# Altium schematic sheet fpga_block.SchDoc
size A3
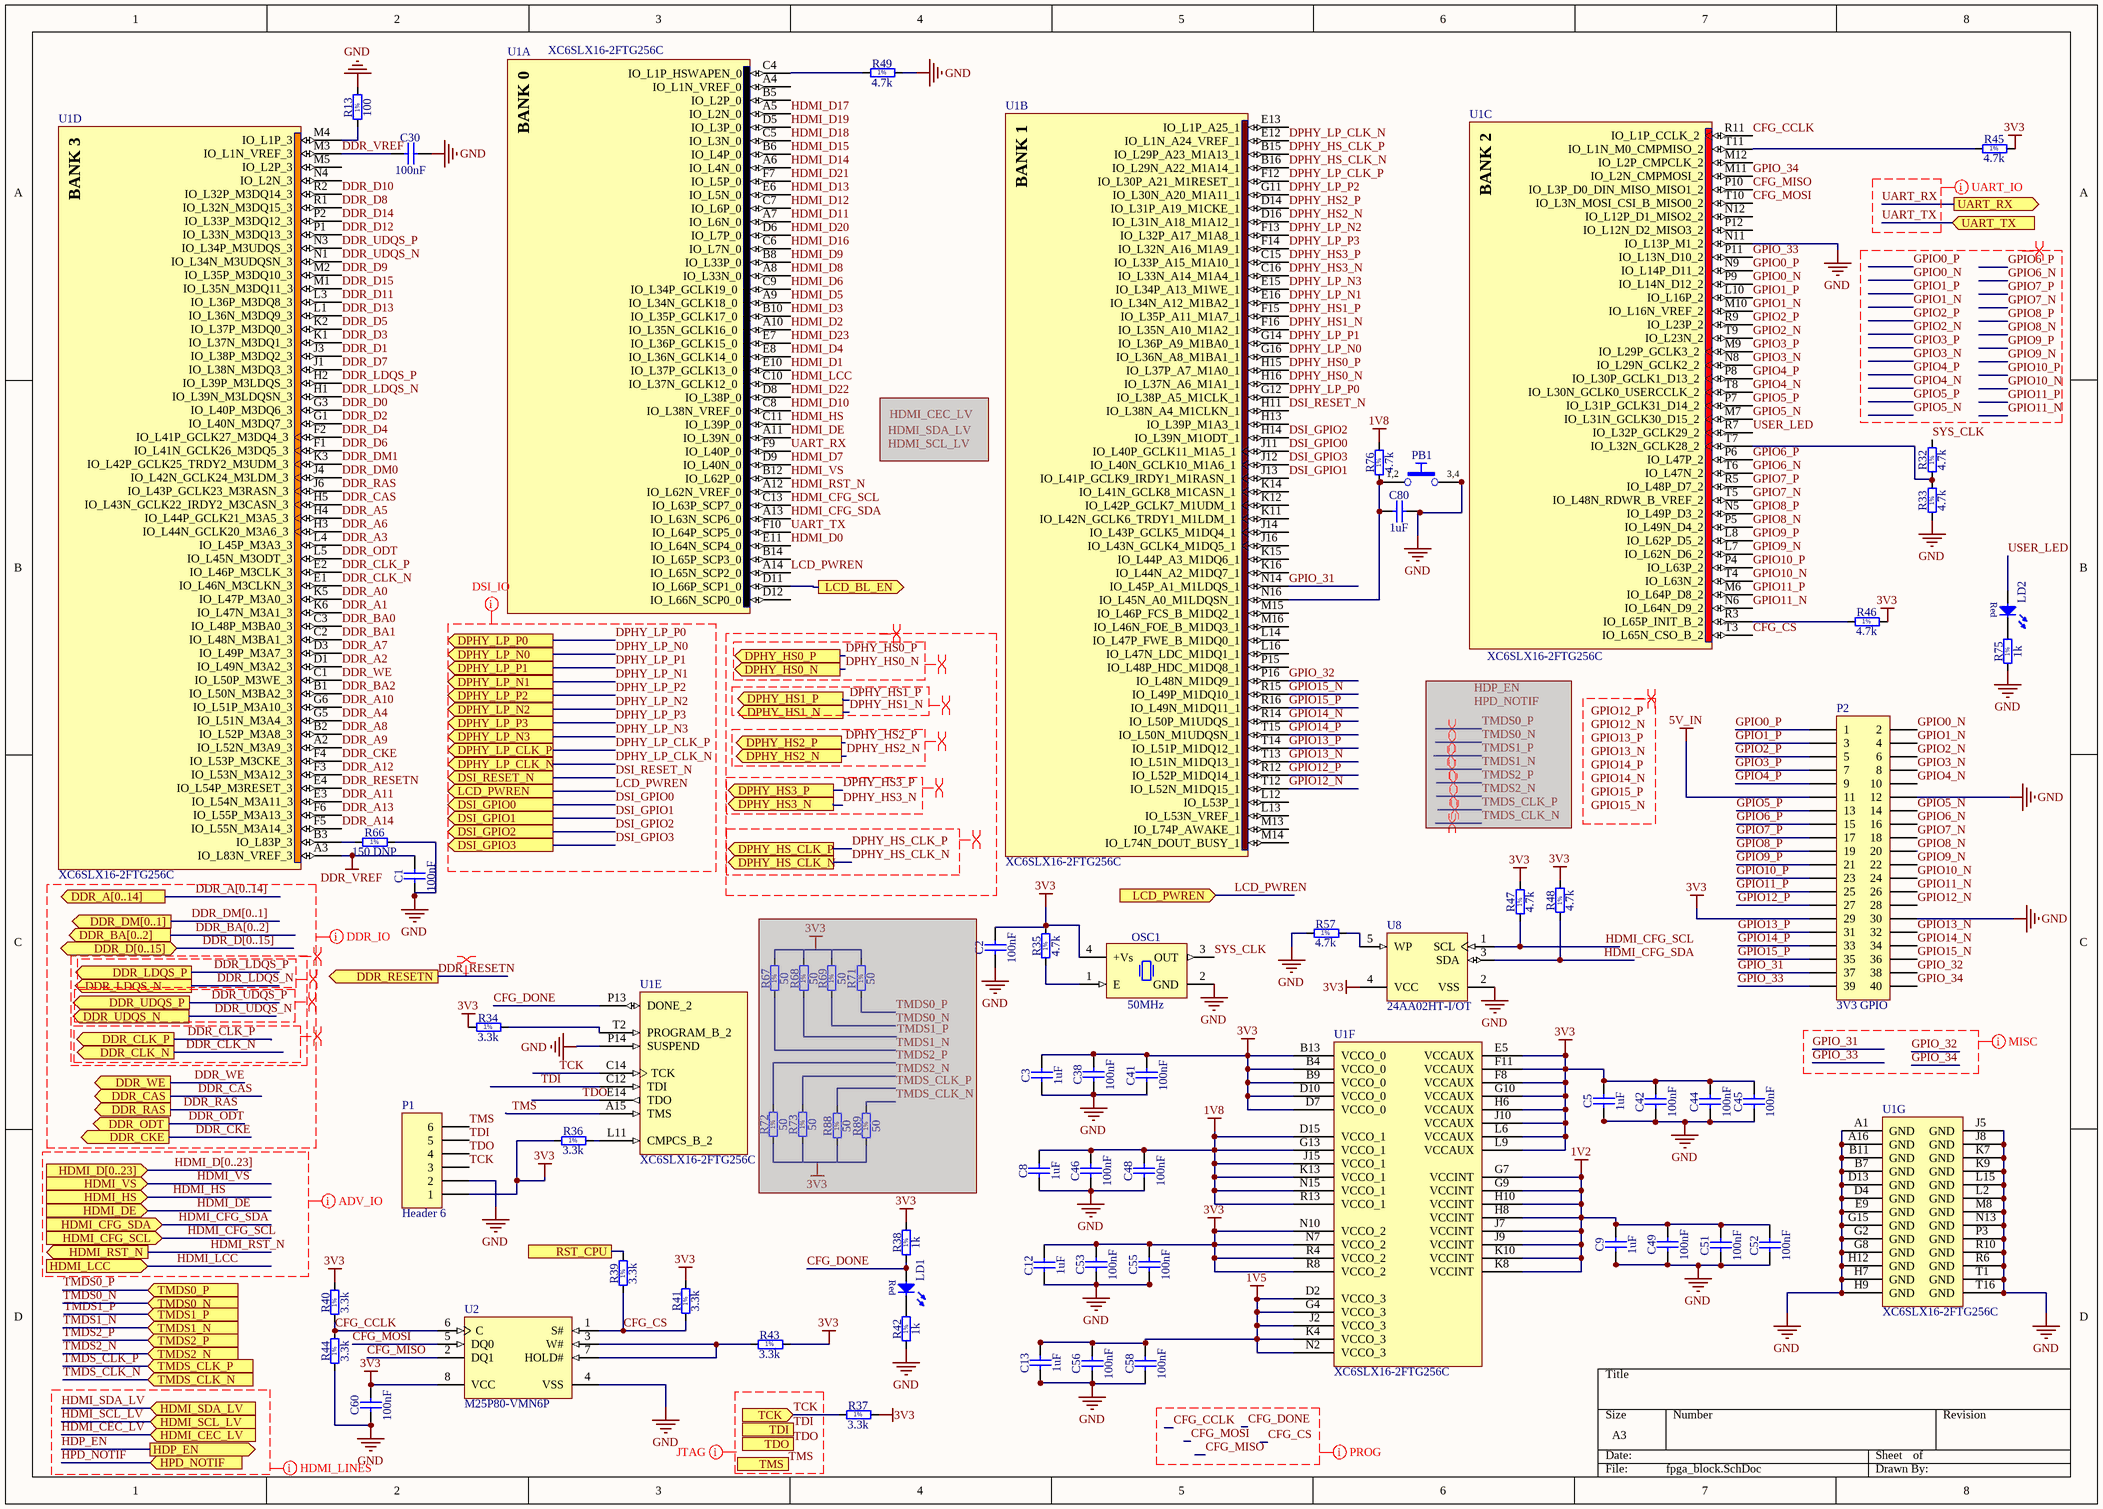
[diagram p0: fpga_block.SchDoc]

## Parts
C1  100nF  [CAPC1005X55N]
C2  100nF  [CAPC1005X55N]
C3  1uF  [CAPC1005X55N]
C5  1uF  [CAPC1005X55N]
C8  1uF  [CAPC1005X55N]
C9  1uF  [CAPC1005X55N]
C12  1uF  [CAPC1005X55N]
C13  1uF  [CAPC1005X55N]
C30  100nF  [CAPC1005X55N]
C38  100nF  [CAPC1005X55N]
C41  100nF  [CAPC1005X55N]
C42  100nF  [CAPC1005X55N]
C44  100nF  [CAPC1005X55N]
C45  100nF  [CAPC1005X55N]
C46  100nF  [CAPC1005X55N]
C48  100nF  [CAPC1005X55N]
C49  100nF  [CAPC1005X55N]
C51  100nF  [CAPC1005X55N]
C52  100nF  [CAPC1005X55N]
C53  100nF  [CAPC1005X55N]
C55  100nF  [CAPC1005X55N]
C56  100nF  [CAPC1005X55N]
C58  100nF  [CAPC1005X55N]
C60  100nF  [CAPC2013X100N]
C80  1uF  [CAPC1005X55N]
LD1  Super Red  [LED_OSRAM_LSR976]  (value not drawn)
LD2  Super Red  [LED_OSRAM_LSR976]  (value not drawn)
OSC1  50MHz  [OSC_IQD_CFPS-69]
P1  Header 6  [HDR1X6]
P2  3V3 GPIO  [HDR2X20]
PB1  Push Button  [PB_TYCO_FSM6JSMA]  (value not drawn)
R13  100  [RESC1608X55N]
R32  4.7k  [RESC1608X55N]
R33  4.7k  [RESC1608X55N]
R34  3.3k  [RESC1608X55N]
R35  4.7k  [RESC1608X55N]
R36  3.3k  [RESC1608X55N]
R37  3.3k  [RESC1608X55N]
R38  1k  [RESC1608X55N]
R39  3.3k  [RESC1608X55N]
R40  3.3k  [RESC1608X55N]
R41  3.3k  [RESC1608X55N]
R42  1k  [RESC1608X55N]
R43  3.3k  [RESC1608X55N]
R44  3.3k  [RESC1608X55N]
R45  4.7k  [RESC1608X55N]
R46  4.7k  [RESC1608X55N]
R47  4.7k  [RESC1608X55N]
R48  4.7k  [RESC1608X55N]
R49  4.7k  [RESC1608X55N]
R57  4.7k  [RESC1608X55N]
R66  150 DNP  [RESC1608X55N]
R67  50  [RESC1005X40N]  (masked out: inside a compile mask, not in the netlist)
R68  50  [RESC1005X40N]  (masked out: inside a compile mask, not in the netlist)
R69  50  [RESC1005X40N]  (masked out: inside a compile mask, not in the netlist)
R71  50  [RESC1005X40N]  (masked out: inside a compile mask, not in the netlist)
R72  50  [RESC1005X40N]  (masked out: inside a compile mask, not in the netlist)
R73  50  [RESC1005X40N]  (masked out: inside a compile mask, not in the netlist)
R75  1k  [RESC1608X55N]
R76  4.7k  [RESC1608X55N]
R88  50  [RESC1005X40N]  (masked out: inside a compile mask, not in the netlist)
R89  50  [RESC1005X40N]  (masked out: inside a compile mask, not in the netlist)
U1  XC6SLX16-2FTG256C  [FTG256]  (parts A,B,C,D,E,F,G of 7)
U2  M25P80-VMN6P  [MICT-MN-8_N]
U8  24AA02HT-I/OT  [SOT-23-OT5_L]

## Ports
DDR_A[0..14] (out), DDR_BA[0..2] (out), DDR_CAS (out), DDR_CKE (out), DDR_CLK_N (out), DDR_CLK_P (out), DDR_D[0..15] (bidir), DDR_DM[0..1] (out), DDR_LDQS_N (out), DDR_LDQS_P (out), DDR_ODT (out), DDR_RAS (out), DDR_RESETN (out), DDR_UDQS_N (out), DDR_UDQS_P (out), DDR_WE (out), DPHY_HS0_N (out), DPHY_HS0_P (out), DPHY_HS1_N (out), DPHY_HS1_P (out), DPHY_HS2_N (out), DPHY_HS2_P (out), DPHY_HS3_N (out), DPHY_HS3_P (out), DPHY_HS_CLK_N (out), DPHY_HS_CLK_P (out), DPHY_LP_CLK_N (out), DPHY_LP_CLK_P (out), DPHY_LP_N0 (out), DPHY_LP_N1 (out), DPHY_LP_N2 (out), DPHY_LP_N3 (out), DPHY_LP_P0 (out), DPHY_LP_P1 (out), DPHY_LP_P2 (out), DPHY_LP_P3 (out), DSI_GPIO0 (out), DSI_GPIO1 (out), DSI_GPIO2 (out), DSI_GPIO3 (out), DSI_RESET_N (out), HDMI_CEC_LV (in), HDMI_CFG_SCL (in), HDMI_CFG_SDA (in), HDMI_D[0..23] (in), HDMI_DE (in), HDMI_HS (in), HDMI_LCC (in), HDMI_RST_N (out), HDMI_SCL_LV (in), HDMI_SDA_LV (in), HDMI_VS (in), HDP_EN (out), HPD_NOTIF (in), LCD_BL_EN (out), LCD_PWREN (in), LCD_PWREN (out), RST_CPU, TCK (in), TDI (in), TDO (out), TMDS0_N (in), TMDS0_P (in), TMDS1_N (in), TMDS1_P (in), TMDS2_N (in), TMDS2_P (in), TMDS_CLK_N (in), TMDS_CLK_P (in), TMS (out), UART_RX (out), UART_TX (in)

## Nets
1V2: C9.2 C49.2 C51.2 C52.2 U1.G7(VCCINT) U1.G9(VCCINT) U1.H8(VCCINT) U1.H10(VCCINT) U1.J7(VCCINT) U1.J9(VCCINT) U1.K8(VCCINT) U1.K10(VCCINT)
1V5: C13.2 C56.2 C58.2 U1.D2(VCCO_3) U1.G4(VCCO_3) U1.J2(VCCO_3) U1.K4(VCCO_3) U1.N2(VCCO_3)
1V8: C8.2 C46.2 C48.2 R76.2 U1.D15(VCCO_1) U1.G13(VCCO_1) U1.J15(VCCO_1) U1.K13(VCCO_1) U1.N15(VCCO_1) U1.R13(VCCO_1)
3V3: C2.2 C3.2 C5.2 C12.2 C38.2 C41.2 C42.2 C44.2 C45.2 C53.2 C55.2 C60.2 OSC1.4(+Vs) P1.1 P2.29 R34.1 R35.2 R36.1 R37.2 R38.2 R40.2 R41.2 R43.2 R45.2 R46.2 R47.2 R48.2 U1.B4(VCCO_0) U1.B9(VCCO_0) U1.B13(VCCO_0) U1.D7(VCCO_0) U1.D10(VCCO_0) U1.E5(VCCAUX) U1.F8(VCCAUX) U1.F11(VCCAUX) U1.G10(VCCAUX) U1.H6(VCCAUX) U1.J10(VCCAUX) U1.L6(VCCAUX) U1.L9(VCCAUX) U1.N7(VCCO_2) U1.N10(VCCO_2) U1.R4(VCCO_2) U1.R8(VCCO_2) U2.8(VCC) U8.4(VCC)
5V_IN: P2.11
DDR_VREF: C1.2 C30.1 U1.A3(IO_L83N_VREF_3) U1.M3(IO_L1N_VREF_3)
GND: C1.1 C2.1 C3.1 C5.1 C8.1 C9.1 C12.1 C13.1 C30.2 C38.1 C41.1 C42.1 C44.1 C45.1 C46.1 C48.1 C49.1 C51.1 C52.1 C53.1 C55.1 C56.1 C58.1 C60.1 C80.2 OSC1.2(GND) P1.2 P2.12 P2.30 PB1.3 PB1.4 R13.2 R33.1 R42.1 R44.1 R49.2 R57.1 R66.2 R75.1 U1.A1(GND) U1.A16(GND) U1.B7(GND) U1.B11(GND) U1.D4(GND) U1.D13(GND) U1.E9(GND) U1.G2(GND) U1.G8(GND) U1.G15(GND) U1.H7(GND) U1.H9(GND) U1.H12(GND) U1.J5(GND) U1.J8(GND) U1.K7(GND) U1.K9(GND) U1.L2(GND) U1.L15(GND) U1.M8(GND) U1.N11(IO_L13P_M1_2) U1.N13(GND) U1.P3(GND) U1.P14(SUSPEND) U1.R6(GND) U1.R10(GND) U1.T1(GND) U1.T16(GND) U2.4(VSS) U8.2(VSS)
CFG_CCLK: R40.1 R44.2 U1.R11(IO_L1P_CCLK_2) U2.6(C)
CFG_CS: R39.1 R41.1 U1.T3(IO_L65N_CSO_B_2) U2.1(S#)
CFG_DONE: LD1.2(A) R38.1 U1.P13(DONE_2)
CFG_MISO: U1.P10(IO_L3P_D0_DIN_MISO_MISO1_2) U2.2(DQ1)
CFG_MOSI: U1.T10(IO_L3N_MOSI_CSI_B_MISO0_2) U2.5(DQ0)
DDR_A0: U1.K5(IO_L47P_M3A0_3)
DDR_A1: U1.K6(IO_L47N_M3A1_3)
DDR_A2: U1.D1(IO_L49N_M3A2_3)
DDR_A3: U1.L4(IO_L45P_M3A3_3)
DDR_A4: U1.G5(IO_L51N_M3A4_3)
DDR_A5: U1.H4(IO_L44P_GCLK21_M3A5_3)
DDR_A6: U1.H3(IO_L44N_GCLK20_M3A6_3)
DDR_A7: U1.D3(IO_L49P_M3A7_3)
DDR_A8: U1.B2(IO_L52P_M3A8_3)
DDR_A9: U1.A2(IO_L52N_M3A9_3)
DDR_A10: U1.G6(IO_L51P_M3A10_3)
DDR_A11: U1.E3(IO_L54N_M3A11_3)
DDR_A12: U1.F3(IO_L53N_M3A12_3)
DDR_A13: U1.F6(IO_L55P_M3A13_3)
DDR_A14: U1.F5(IO_L55N_M3A14_3)
DDR_BA0: U1.C3(IO_L48P_M3BA0_3)
DDR_BA1: U1.C2(IO_L48N_M3BA1_3)
DDR_BA2: U1.B1(IO_L50N_M3BA2_3)
DDR_CAS: U1.H5(IO_L43N_GCLK22_IRDY2_M3CASN_3) ; port DDR_CAS
DDR_CKE: U1.F4(IO_L53P_M3CKE_3) ; port DDR_CKE
DDR_CLK_N: U1.E1(IO_L46N_M3CLKN_3) ; port DDR_CLK_N
DDR_CLK_P: U1.E2(IO_L46P_M3CLK_3) ; port DDR_CLK_P
DDR_D0: U1.G3(IO_L40P_M3DQ6_3)
DDR_D1: U1.J3(IO_L38P_M3DQ2_3)
DDR_D2: U1.G1(IO_L40N_M3DQ7_3)
DDR_D3: U1.K1(IO_L37N_M3DQ1_3)
DDR_D4: U1.F2(IO_L41P_GCLK27_M3DQ4_3)
DDR_D5: U1.K2(IO_L37P_M3DQ0_3)
DDR_D6: U1.F1(IO_L41N_GCLK26_M3DQ5_3)
DDR_D7: U1.J1(IO_L38N_M3DQ3_3)
DDR_D8: U1.R1(IO_L32N_M3DQ15_3)
DDR_D9: U1.M2(IO_L35P_M3DQ10_3)
DDR_D10: U1.R2(IO_L32P_M3DQ14_3)
DDR_D11: U1.L3(IO_L36P_M3DQ8_3)
DDR_D12: U1.P1(IO_L33N_M3DQ13_3)
DDR_D13: U1.L1(IO_L36N_M3DQ9_3)
DDR_D14: U1.P2(IO_L33P_M3DQ12_3)
DDR_D15: U1.M1(IO_L35N_M3DQ11_3)
DDR_DM0: U1.J4(IO_L42N_GCLK24_M3LDM_3)
DDR_DM1: U1.K3(IO_L42P_GCLK25_TRDY2_M3UDM_3)
DDR_LDQS_N: U1.H1(IO_L39N_M3LDQSN_3) ; port DDR_LDQS_N
DDR_LDQS_P: U1.H2(IO_L39P_M3LDQS_3) ; port DDR_LDQS_P
DDR_ODT: U1.L5(IO_L45N_M3ODT_3) ; port DDR_ODT
DDR_RAS: U1.J6(IO_L43P_GCLK23_M3RASN_3) ; port DDR_RAS
DDR_RESETN: U1.E4(IO_L54P_M3RESET_3) ; port DDR_RESETN
DDR_UDQS_N: U1.N1(IO_L34N_M3UDQSN_3) ; port DDR_UDQS_N
DDR_UDQS_P: U1.N3(IO_L34P_M3UDQS_3) ; port DDR_UDQS_P
DDR_WE: U1.C1(IO_L50P_M3WE_3) ; port DDR_WE
DPHY_HS0_N: U1.H16(IO_L37N_A6_M1A1_1) ; port DPHY_HS0_N
DPHY_HS0_P: U1.H15(IO_L37P_A7_M1A0_1) ; port DPHY_HS0_P
DPHY_HS1_N: U1.F16(IO_L35N_A10_M1A2_1) ; port DPHY_HS1_N
DPHY_HS1_P: U1.F15(IO_L35P_A11_M1A7_1) ; port DPHY_HS1_P
DPHY_HS2_N: U1.D16(IO_L31N_A18_M1A12_1) ; port DPHY_HS2_N
DPHY_HS2_P: U1.D14(IO_L31P_A19_M1CKE_1) ; port DPHY_HS2_P
DPHY_HS3_N: U1.C16(IO_L33N_A14_M1A4_1) ; port DPHY_HS3_N
DPHY_HS3_P: U1.C15(IO_L33P_A15_M1A10_1) ; port DPHY_HS3_P
DPHY_HS_CLK_N: U1.B16(IO_L29N_A22_M1A14_1) ; port DPHY_HS_CLK_N
DPHY_HS_CLK_P: U1.B15(IO_L29P_A23_M1A13_1) ; port DPHY_HS_CLK_P
DPHY_LP_CLK_N: U1.E12(IO_L1N_A24_VREF_1) ; port DPHY_LP_CLK_N
DPHY_LP_CLK_P: U1.F12(IO_L30P_A21_M1RESET_1) ; port DPHY_LP_CLK_P
DPHY_LP_N0: U1.G16(IO_L36N_A8_M1BA1_1) ; port DPHY_LP_N0
DPHY_LP_N1: U1.E16(IO_L34N_A12_M1BA2_1) ; port DPHY_LP_N1
DPHY_LP_N2: U1.F13(IO_L32P_A17_M1A8_1) ; port DPHY_LP_N2
DPHY_LP_N3: U1.E15(IO_L34P_A13_M1WE_1) ; port DPHY_LP_N3
DPHY_LP_P0: U1.G12(IO_L38P_A5_M1CLK_1) ; port DPHY_LP_P0
DPHY_LP_P1: U1.G14(IO_L36P_A9_M1BA0_1) ; port DPHY_LP_P1
DPHY_LP_P2: U1.G11(IO_L30N_A20_M1A11_1) ; port DPHY_LP_P2
DPHY_LP_P3: U1.F14(IO_L32N_A16_M1A9_1) ; port DPHY_LP_P3
DSI_GPIO0: U1.J11(IO_L40P_GCLK11_M1A5_1) ; port DSI_GPIO0
DSI_GPIO1: U1.J13(IO_L41P_GCLK9_IRDY1_M1RASN_1) ; port DSI_GPIO1
DSI_GPIO2: U1.H14(IO_L39N_M1ODT_1) ; port DSI_GPIO2
DSI_GPIO3: U1.J12(IO_L40N_GCLK10_M1A6_1) ; port DSI_GPIO3
DSI_RESET_N: U1.H11(IO_L38N_A4_M1CLKN_1) ; port DSI_RESET_N
GPIO0_N: P2.2 U1.P9(IO_L14N_D12_2)
GPIO0_P: P2.1 U1.N9(IO_L14P_D11_2)
GPIO1_N: P2.4 U1.M10(IO_L16N_VREF_2)
GPIO1_P: P2.3 U1.L10(IO_L16P_2)
GPIO2_N: P2.6 U1.T9(IO_L23N_2)
GPIO2_P: P2.5 U1.R9(IO_L23P_2)
GPIO3_N: P2.8 U1.N8(IO_L29N_GCLK2_2)
GPIO3_P: P2.7 U1.M9(IO_L29P_GCLK3_2)
GPIO4_N: P2.10 U1.T8(IO_L30N_GCLK0_USERCCLK_2)
GPIO4_P: P2.9 U1.P8(IO_L30P_GCLK1_D13_2)
GPIO5_N: P2.14 U1.M7(IO_L31N_GCLK30_D15_2)
GPIO5_P: P2.13 U1.P7(IO_L31P_GCLK31_D14_2)
GPIO6_N: P2.16 U1.T6(IO_L47N_2)
GPIO6_P: P2.15 U1.P6(IO_L47P_2)
GPIO7_N: P2.18 U1.T5(IO_L48N_RDWR_B_VREF_2)
GPIO7_P: P2.17 U1.R5(IO_L48P_D7_2)
GPIO8_N: P2.20 U1.P5(IO_L49N_D4_2)
GPIO8_P: P2.19 U1.N5(IO_L49P_D3_2)
GPIO9_N: P2.22 U1.L7(IO_L62N_D6_2)
GPIO9_P: P2.21 U1.L8(IO_L62P_D5_2)
GPIO10_N: P2.24 U1.T4(IO_L63N_2)
GPIO10_P: P2.23 U1.P4(IO_L63P_2)
GPIO11_N: P2.26 U1.N6(IO_L64N_D9_2)
GPIO11_P: P2.25 U1.M6(IO_L64P_D8_2)
GPIO12_N: P2.28 U1.T12(IO_L52N_M1DQ15_1)
GPIO12_P: P2.27 U1.R12(IO_L52P_M1DQ14_1)
GPIO13_N: P2.32 U1.T13(IO_L51N_M1DQ13_1)
GPIO13_P: P2.31 U1.T14(IO_L51P_M1DQ12_1)
GPIO14_N: P2.34 U1.R14(IO_L50P_M1UDQS_1)
GPIO14_P: P2.33 U1.T15(IO_L50N_M1UDQSN_1)
GPIO15_N: P2.36 U1.R15(IO_L49P_M1DQ10_1)
GPIO15_P: P2.35 U1.R16(IO_L49N_M1DQ11_1)
GPIO_31: P2.37 U1.N14(IO_L45P_A1_M1LDQS_1)
GPIO_32: P2.38 U1.P16(IO_L48N_M1DQ9_1)
GPIO_33: P2.39 U1.P11(IO_L13N_D10_2)
GPIO_34: P2.40 U1.M11(IO_L2N_CMPMOSI_2)
HDMI_CEC_LV: port HDMI_CEC_LV
HDMI_CFG_SCL: R47.1 U1.C13(IO_L63P_SCP7_0) U8.1(SCL) ; port HDMI_CFG_SCL
HDMI_CFG_SDA: R48.1 U1.A13(IO_L63N_SCP6_0) U8.3(SDA) ; port HDMI_CFG_SDA
HDMI_D0: U1.E11(IO_L64N_SCP4_0)
HDMI_D1: U1.E10(IO_L37P_GCLK13_0)
HDMI_D2: U1.A10(IO_L35N_GCLK16_0)
HDMI_D3: U1.B10(IO_L35P_GCLK17_0)
HDMI_D4: U1.E8(IO_L36N_GCLK14_0)
HDMI_D5: U1.A9(IO_L34N_GCLK18_0)
HDMI_D6: U1.C9(IO_L34P_GCLK19_0)
HDMI_D7: U1.D9(IO_L40N_0)
HDMI_D8: U1.A8(IO_L33N_0)
HDMI_D9: U1.B8(IO_L33P_0)
HDMI_D10: U1.C8(IO_L38N_VREF_0)
HDMI_D11: U1.A7(IO_L6N_0)
HDMI_D12: U1.C7(IO_L6P_0)
HDMI_D13: U1.E6(IO_L5N_0)
HDMI_D14: U1.A6(IO_L4N_0)
HDMI_D15: U1.B6(IO_L4P_0)
HDMI_D16: U1.C6(IO_L7N_0)
HDMI_D17: U1.A5(IO_L2N_0)
HDMI_D18: U1.C5(IO_L3N_0)
HDMI_D19: U1.D5(IO_L3P_0)
HDMI_D20: U1.D6(IO_L7P_0)
HDMI_D21: U1.F7(IO_L5P_0)
HDMI_D22: U1.D8(IO_L38P_0)
HDMI_D23: U1.E7(IO_L36P_GCLK15_0)
HDMI_DE: U1.A11(IO_L39N_0) ; port HDMI_DE
HDMI_HS: U1.C11(IO_L39P_0) ; port HDMI_HS
HDMI_LCC: U1.C10(IO_L37N_GCLK12_0) ; port HDMI_LCC
HDMI_RST_N: U1.A12(IO_L62N_VREF_0) ; port HDMI_RST_N
HDMI_SCL_LV: port HDMI_SCL_LV
HDMI_SDA_LV: port HDMI_SDA_LV
HDMI_VS: U1.B12(IO_L62P_0) ; port HDMI_VS
HDP_EN: port HDP_EN
HPD_NOTIF: port HPD_NOTIF
LCD_BL_EN: U1.D11(IO_L66P_SCP1_0) ; port LCD_BL_EN
LCD_PWREN: U1.A14(IO_L65N_SCP2_0) ; port LCD_PWREN
RST_CPU: R39.2 ; port RST_CPU
SYS_CLK: OSC1.3(OUT) R32.2
TCK: P1.3 R37.1 U1.C14(TCK) ; port TCK
TDI: P1.5 U1.C12(TDI) ; port TDI
TDO: P1.4 U1.E14(TDO) ; port TDO
TMDS0_N: port TMDS0_N
TMDS0_P: port TMDS0_P
TMDS1_N: port TMDS1_N
TMDS1_P: port TMDS1_P
TMDS2_N: port TMDS2_N
TMDS2_P: port TMDS2_P
TMDS_CLK_N: port TMDS_CLK_N
TMDS_CLK_P: port TMDS_CLK_P
TMS: P1.6 U1.A15(TMS) ; port TMS
UART_RX: U1.F9(IO_L40P_0) ; port UART_RX
UART_TX: U1.F10(IO_L64P_SCP5_0) ; port UART_TX
USER_LED: LD2.2(A) U1.R7(IO_L32P_GCLK29_2)
NetC80_1: C80.1 PB1.1 PB1.2 R76.1 U1.N16(IO_L45N_A0_M1LDQSN_1)
NetLD1_1: LD1.1(C) R42.2
NetLD2_1: LD2.1(C) R75.2
NetOSC1_1: OSC1.1(E) R35.1
NetR13_1: R13.1 U1.M4(IO_L1P_3)
NetR32_1: R32.1 R33.2 U1.T7(IO_L32N_GCLK28_2)
NetR34_2: R34.2 U1.T2(PROGRAM_B_2)
NetR36_2: R36.2 U1.L11(CMPCS_B_2)
NetR43_1: R43.1 U2.3(W#) U2.7(HOLD#)
NetR45_1: R45.1 U1.T11(IO_L1N_M0_CMPMISO_2)
NetR46_1: R46.1 U1.R3(IO_L65P_INIT_B_2)
NetR49_1: R49.1 U1.C4(IO_L1P_HSWAPEN_0)
NetR57_2: R57.2 U8.5(WP)
NetR66_1: R66.1 U1.B3(IO_L83P_3)

Not connected (* = marked no-connect by the designer): U1 A4(IO_L1N_VREF_0) B5(IO_L2P_0) B14(IO_L65P_SCP3_0) D12(IO_L66N_SCP0_0) E13(IO_L1P_A25_1) H13(IO_L39P_M1A3_1) J14(IO_L43P_GCLK5_M1DQ4_1) J16(IO_L43N_GCLK4_M1DQ5_1) K11(IO_L42N_GCLK6_TRDY1_M1LDM_1) K12(IO_L42P_GCLK7_M1UDM_1) K14(IO_L41N_GCLK8_M1CASN_1) K15(IO_L44P_A3_M1DQ6_1) K16(IO_L44N_A2_M1DQ7_1) L12(IO_L53P_1) L13(IO_L53N_VREF_1) L14(IO_L47P_FWE_B_M1DQ0_1) L16(IO_L47N_LDC_M1DQ1_1) M5(IO_L2P_3) M12(IO_L2P_CMPCLK_2) M13(IO_L74P_AWAKE_1) M14(IO_L74N_DOUT_BUSY_1) M15(IO_L46P_FCS_B_M1DQ2_1) M16(IO_L46N_FOE_B_M1DQ3_1) N4(IO_L2N_3) N12(IO_L12P_D1_MISO2_2) P12(IO_L12N_D2_MISO3_2) P15(IO_L48P_HDC_M1DQ8_1)

## Buses and harness runs
bus DDR_A[0..14] = port DDR_A[0..14]
bus DDR_BA[0..2] = port DDR_BA[0..2]
bus DDR_D[0..15] = port DDR_D[0..15]
bus DDR_DM[0..1] = port DDR_DM[0..1]
bus HDMI_D[0..23] = port HDMI_D[0..23]

## Layout directives
differential pair; rule Differential Pairs Routing [Pref Gap = 0.1mm    Min Gap  = 0.1mm    Max Gap  = 0.2mmPref Width = 0.1mm    Min Width  = 0.1mm    Max Width  = 0.2mm]; rule Clearance Constraint [Clearance = 0.1mm]: GPIO12_N, GPIO12_P, GPIO13_N, GPIO13_P, GPIO14_N, GPIO14_P, GPIO15_N, GPIO15_P
differential pair: (no net found under the mark)
differential pair; net class DPHY_LANE_HS; rule Differential Pairs Routing [Pref Gap = 0.1mm    Min Gap  = 0.1mm    Max Gap  = 0.2mmPref Width = 0.1mm    Min Width  = 0.1mm    Max Width  = 0.2mm]; rule Matched Net Lengths [Tolerance = 1mm]: DPHY_HS0_N, DPHY_HS0_P, DPHY_HS1_N, DPHY_HS1_P, DPHY_HS2_N, DPHY_HS2_P, DPHY_HS3_N, DPHY_HS3_P, DPHY_HS_CLK_N, DPHY_HS_CLK_P
net class DPHY_LINES; rule Clearance Constraint [Clearance = 0.1mm]; rule Width Constraint [Pref Width = 0.1mm    Min Width = 0.1mm    Max Width = 0.2mm]: DPHY_LP_CLK_N, DPHY_LP_CLK_P, DPHY_LP_N0, DPHY_LP_N1, DPHY_LP_N2, DPHY_LP_N3, DPHY_LP_P0, DPHY_LP_P1, DPHY_LP_P2, DPHY_LP_P3, DSI_GPIO0, DSI_GPIO1, DSI_GPIO2, DSI_GPIO3, DSI_RESET_N, LCD_PWREN
differential pair; rule Differential Pairs Routing [Pref Gap = 0.1mm    Min Gap  = 0.1mm    Max Gap  = 0.2mmPref Width = 0.1mm    Min Width  = 0.1mm    Max Width  = 0.2mm]; net class GPIO_DIFFPAIR; rule Clearance Constraint [Clearance = 0.1mm]: GPIO0_N, GPIO0_P, GPIO1_N, GPIO1_P, GPIO2_N, GPIO2_P, GPIO3_N, GPIO3_P, GPIO4_N, GPIO4_P, GPIO5_N, GPIO5_P, GPIO6_N, GPIO6_P, GPIO7_N, GPIO7_P, GPIO8_N, GPIO8_P, GPIO9_N, GPIO9_P, GPIO10_N, GPIO10_P, GPIO11_N, GPIO11_P
rule Clearance Constraint [Clearance = 0.1mm]; net class ADV_IO; rule Width Constraint [Pref Width = 0.1mm    Min Width = 0.1mm    Max Width = 0.2mm]; rule Matched Net Lengths [Tolerance = 3mm]: HDMI_CFG_SCL, HDMI_CFG_SDA, HDMI_D[0..23], HDMI_DE, HDMI_HS, HDMI_LCC, HDMI_RST_N, HDMI_VS
net class HDMI_LINES; rule Clearance Constraint [Clearance = 0.1mm]; rule Width Constraint [Pref Width = 0.1mm    Min Width = 0.1mm    Max Width = 0.2mm]: HDMI_CEC_LV, HDMI_SCL_LV, HDMI_SDA_LV, HDP_EN, HPD_NOTIF
rule Matched Net Lengths [Tolerance = 1mm]; net class DPHY_LANE_HS_0: DPHY_HS0_N, DPHY_HS0_P
rule Matched Net Lengths [Tolerance = 1mm]; net class DPHY_LANE_HS_1: DPHY_HS1_N, DPHY_HS1_P
rule Matched Net Lengths [Tolerance = 1mm]; net class DPHY_LANE_HS_2: DPHY_HS2_N, DPHY_HS2_P
rule Matched Net Lengths [Tolerance = 1mm]; net class DPHY_LANE_HS_3: DPHY_HS3_N, DPHY_HS3_P
rule Matched Net Lengths [Tolerance = 1mm]; net class DPHY_LANE_HS_4: DPHY_HS_CLK_N, DPHY_HS_CLK_P
rule Clearance Constraint [Clearance = 0.1mm]; rule Width Constraint [Pref Width = 0.1mm    Min Width = 0.1mm    Max Width = 0.2mm]; net class JTAG: TCK, TDI, TDO, TMS
rule Width Constraint [Pref Width = 0.1mm    Min Width = 0.1mm    Max Width = 0.2mm]; rule Clearance Constraint [Clearance = 0.1mm]; net class PROG: CFG_CCLK, CFG_CS, CFG_DONE, CFG_MISO, CFG_MOSI
rule Width Constraint [Pref Width = 0.1mm    Min Width = 0.1mm    Max Width = 0.2mm]; rule Clearance Constraint [Clearance = 0.1mm]: GPIO_31, GPIO_32, GPIO_33, GPIO_34
differential pair; rule Differential Pairs Routing [Pref Gap = 0.1mm    Min Gap  = 0.1mm    Max Gap  = 0.2mmPref Width = 0.1mm    Min Width  = 0.1mm    Max Width  = 0.1mm]; rule Clearance Constraint [Clearance = 0.1mm]; differential pair class DDR_lvds: DDR_CLK_N, DDR_CLK_P, DDR_LDQS_N, DDR_LDQS_P, DDR_UDQS_N, DDR_UDQS_P
rule Width Constraint [Pref Width = 0.1mm    Min Width = 0.1mm    Max Width = 0.3mm]; rule Clearance Constraint [Clearance = 0.1mm]: DDR_RESETN
net class DDR_IO; rule Clearance Constraint [Clearance = 0.1mm]; rule Width Constraint [Pref Width = 0.1mm    Min Width = 0.1mm    Max Width = 0.2mm]; rule Matched Net Lengths [Tolerance = 1mm]: DDR_A[0..14], DDR_BA[0..2], DDR_CAS, DDR_CKE, DDR_CLK_N, DDR_CLK_P, DDR_D[0..15], DDR_DM[0..1], DDR_LDQS_N, DDR_LDQS_P, DDR_ODT, DDR_RAS, DDR_UDQS_N, DDR_UDQS_P, DDR_WE
rule Matched Net Lengths [Tolerance = 1mm]: DDR_CLK_N, DDR_CLK_P, DDR_LDQS_N, DDR_LDQS_P, DDR_UDQS_N, DDR_UDQS_P
net class UART_NET_CLASS; rule Width Constraint [Pref Width = 0.1mm    Min Width = 0.1mm    Max Width = 0.15mm]; rule Clearance Constraint [Clearance = 0.1mm]: UART_RX, UART_TX

## Notes on the sheet
- Labels drawn without touching a wire or pin: GPIO12_N, GPIO12_P, GPIO13_N, GPIO13_P, GPIO14_N, GPIO14_P, GPIO15_N, GPIO15_P
- (in symbol LED_OSRAM_LSR976) Red
- (in symbol PB_TYCO_FSM6JSMA) 1,2; 3,4
- (in symbol R0402_51K_1%_0.0625W_100PPM) 1%
- (in symbol R0603_100K_1%_0.1W_100PPM) 1%
- (in symbol XC6SLX16-2FTG256C, part A) BANK 0
- (in symbol XC6SLX16-2FTG256C, part B) BANK 1
- (in symbol XC6SLX16-2FTG256C, part C) BANK 2
- (in symbol XC6SLX16-2FTG256C, part D) BANK 3

## Library data of the parts
C1 C2 C30 C38 C41 C42 C44-C46 C48 C49 C51-C53 C55 C56 C58 = CC0402_100NF_16V_10%_X5R: Non-polarised capacitor; Part Description: SMD Multilayer Chip Ceramic Capacitor; Manufacturer: GENERIC; Manufacturer1 Part Number: GRM155R61C104KA88D; Voltage: 16V; TC: X5R; Tolerance: ±10%; Part Number: CC0402_100NF_16V_10%_X5R; Component Kind: Standard; Component Type: Standard; Pin Count: 2; Value: 100nF; Status: None; Manufacturer Part Number: CC0402_100NF_16V_10%_X5R; Case: 0402; Mounted: Yes; Socket: No; SMD: Yes; Sense: No; Manufacturer1 Example: MURATA; Manufacturer1 ComponentHeight: 0.55mm; HelpURL: \\cern.ch\dfs\Applications\Altium\Datasheets\CC0402_X5R_MURATA_GRM.pdf; Author: CERN DEM JLC; CreateDate: 10.12.2013; LatestRevisionDate: 10.12.2013
C3 C5 C8 C9 C12 C13 C80 = CC0402_100NF_16V_10%_X5R: Non-polarised capacitor; Part Description: SMD Multilayer Chip Ceramic Capacitor; Manufacturer: GENERIC; Manufacturer1 Part Number: GRM155R61C104KA88D; Value: 100nF; Voltage: 16V; TC: X5R; Tolerance: ±10%; Part Number: CC0402_100NF_16V_10%_X5R; Component Kind: Standard; Component Type: Standard; Pin Count: 2; Status: None; Manufacturer Part Number: CC0402_100NF_16V_10%_X5R; Case: 0402; Mounted: Yes; Socket: No; SMD: Yes; Sense: No; Manufacturer1 Example: MURATA; Manufacturer1 ComponentHeight: 0.55mm; HelpURL: \\cern.ch\dfs\Applications\Altium\Datasheets\CC0402_X5R_MURATA_GRM.pdf; Author: CERN DEM JLC; CreateDate: 10.12.2013; LatestRevisionDate: 10.12.2013
C60 = CC0805_1.5NF_50V_5%_C0G: Non-polarised capacitor; Part Description: SMD Multilayer Chip Ceramic Capacitor; Manufacturer: GENERIC; Manufacturer1 Part Number: C0805C152J5GACTU; Value: 1.5nF; Voltage: 50V; TC: C0G/NP0; Tolerance: ±5%; Part Number: CC0805_1.5NF_50V_5%_C0G; Component Kind: Standard; Component Type: Standard; Pin Count: 2; Status: Preferred; Manufacturer Part Number: CC0805_1.5NF_50V_5%_C0G; Case: 0805; Mounted: Yes; Socket: No; SMD: Yes; Sense: No; Manufacturer1 Example: KEMET; Manufacturer1 ComponentHeight: 1mm; HelpURL: \\cern.ch\dfs\Applications\Altium\Datasheets\CC0805_C0G_KEMET_(Commercial Grade).pdf; Author: CERN DEM BC; CreateDate: 18.11.2015; LatestRevisionDate: 18.11.2015
LD1 LD2 = LED_OSRAM_LSR976: LED Red 1C 2A; Part Description: Surface Mount Super Red LED (0805 Case); Manufacturer: OSRAM; Manufacturer Part Number: LSR976; PressFit: No; Bonding: No; Part Number: LED_OSRAM_LSR976; Component Kind: Standard; Component Type: Standard; Color: Super Red; PackageDescription: Super Red Chip LED, 2-Leads, Body 2 x1.25mm, IPC Medium Density; Pin Count: 2; Case: 0805; Mounted: Yes; Socket: No; SMD: Yes; Sense: No; ComponentHeight: 0.9mm; HelpURL: \\cern.ch\dfs\Applications\Altium\Datasheets\LED_OSRAM_LSR976.pdf; Author: CERN DEM JLC; CreateDate: 18.05.2010; LatestRevisionDate: 18.05.2010
OSC1 = OSC_50MHZ_IQD_LFSPXO009592: Oscillator 4 pins 1=E 2=GND 3=OUT 4=+Vs; Part Description: 3.3V, ±50ppm,  -40..85°C, CMOS Surface Mount Clock Oscillator, Low Current (CFPS-69 Series); Manufacturer: IQD FREQUENCY PRODUCTS; PressFit: No; Bonding: No; Part Number: OSC_50MHZ_IQD_LFSPXO009592; Component Kind: Standard; Component Type: Standard; PackageDescription: Oscillator, Side Concave, 2.54mm Pitch, 4 Pins, 3.20mm L X 5.00mm W X 1.00mm H, CFPS-69 Series; Value: 50MHz; Manufacturer Part Number: LFSPXO009592; Pin Count: 4; Mounted: Yes; Socket: No; SMD: Yes; Sense: No; ComponentHeight: 0.95mm; HelpURL: \\cern.ch\dfs\Applications\Altium\Datasheets\OSC_IQD_LFSPXO009592.pdf; Author: CERN DEM JLC; CreateDate: 16.03.2010; LatestRevisionDate: 07.11.2016
P1 = Header 6: Header, 6-Pin; LatestRevisionDate: 17-Jul-2002; LatestRevisionNote: Re-released for DXP Platform.; Publisher: Altium Limited
P2 = Header 20X2: Header, 20-Pin, Dual row; LatestRevisionDate: 17-Jul-2002; LatestRevisionNote: Re-released for DXP Platform.; Publisher: Altium Limited
PB1 = PB_TYCO_FSM6JSMA: Push-Button Switch SPDT; Part Description: 12VDC 50mA SPST Tactile  Push-Button Switch; Manufacturer: TYCO ELECTRONICS; Manufacturer Part Number: FSM6JSMA or  4-1437565-9; PressFit: No; Part Number: PB_TYCO_FSM6JSMA; Component Kind: Standard; Component Type: Standard; Pin Count: 4; PackageDescription: Body 6mm x 6mm, Surface Mount Tactile Switches, TYCO ALCOSWITCH FSMJSMA Series; Family: Push Button; Mounted: Yes; Socket: No; SMD: Yes; Sense: No; Status: None; ComponentHeight: 7.11mm; HelpURL: \\cern.ch\dfs\Applications\Altium\Datasheets\PB_TYCO_FSM6JSMA.pdf; Author: CERN DEM JLC; CreateDate: 21.06.2012; LatestRevisionDate: 21.06.2012
R13 R32-R49 R57 R66 R75 R76 = R0603_100K_1%_0.1W_100PPM: Resistor - 1%; Part Description: General Purpose Thick Film Chip Resistor; Manufacturer: GENERIC; Manufacturer1 Part Number: NRC06F1003TRF; Value: 100k; Power: 0.1W; TC: ±100ppm/°C; PressFit: No; Part Number: R0603_100K_1%_0.1W_100PPM; Component Kind: Standard; Component Type: Standard; Pin Count: 2; Status: Preferred; Tolerance: ±1%; Manufacturer Part Number: R0603_100K_1%_0.1W_100PPM; Case: 0603; Mounted: Yes; Sense: No; Socket: No; SMD: Yes; Manufacturer1 Example: NIC COMPONENT; Manufacturer1 ComponentHeight: 0.55mm; HelpURL: \\cern.ch\dfs\Applications\Altium\Datasheets\R0603_NIC_NRC.pdf; Author: CERN DEM JLC; CreateDate: 03.12.2007; LatestRevisionDate: 13.03.2008
R67-R69 R71-R73 R88 R89 = R0402_51K_1%_0.0625W_100PPM: Resistor - 1%; Part Description: General Purpose Thick Film Chip Resistor; Manufacturer: GENERIC; Manufacturer1 Part Number: 232270674703L; Value: 51k; TC: ±100ppm/°C; PressFit: No; Part Number: R0402_51K_1%_0.0625W_100PPM; Component Kind: Standard; Component Type: Standard; Pin Count: 2; Status: Not Recommended; Power: 0.0625W; Tolerance: ±1%; Manufacturer Part Number: R0402_51K_1%_0.0625W_100PPM; Case: 0402; Mounted: Yes; Sense: No; Socket: No; SMD: Yes; Manufacturer1 Example: YAGEO PHYCOMP; Manufacturer1 ComponentHeight: 0.4mm; HelpURL: \\cern.ch\dfs\Applications\Altium\Datasheets\R0402_Phycomp_RC0402.pdf; Author: CERN DEM JLC; CreateDate: 03.12.2007; LatestRevisionDate: 17.10.2012
U1 = XC6SLX16-2FTG256C: Spartan-6 LX 1.2V FPGA, 186 User I/Os, 256-Ball Fine-Pitch Thin BGA (1.0mm Pitch), Speed Grade 2, Commercial Grade, Pb-Free; DatasheetVersion: ver1.6, Nov-2010; PackageVersion: ver1.3, Oct-2007; PackageReference: FTG256; PackageDescription: 256-Ball Fine Pitch Thin Ball Grid Array 1.00 mm Pitch (FTG256) - Pb-Free; Code_JEDEC: MS-034-AAF-1*; ComponentLink1Description: Manufacturer URL; ComponentLink1URL: http://www.xilinx.com/; ComponentLink2Description: Spartan-6 Datasheet; ComponentLink2URL: http://www.xilinx.com/support/documentation/data_sheets/ds160.pdf; ComponentLink3Description: Spartan-6 Documents; ComponentLink3URL: http://www.xilinx.com/support/documentation/spartan-6.htm
U2 = M25P80-VMN6P: 8 Mb (x1) Serial NOR Flash Memory, 75 MHz, 2.7 to 3.6 V, 8-pin SO8 Narrow (MN), Tube; Part Family: M25P; Manufacturer: Micron; Density: 8Mb; Speed: 75 MHz; Voltage: 2.7V-3.6V; DatasheetVersion: Rev. Y; PackageVersion: Rev 11; PackageReference: MICT-MN-8; PackageDescription: 8-Pin SO Narrow, 3.9 X 4.9 mm, Pitch 1.27 mm; Applications: Embedded; Package: SO8 Narrow; Part Status: Production; RoHS: Yes; Type: Data Storage; Width: x1; Mounting Technology: Surface Mount; PartNumber: M25P80-VMN6P; ComponentLink1Description: Manufacturer URL; ComponentLink1URL: http://www.micron.com/; ComponentLink2Description: Datasheet; ComponentLink2URL: http://www.micron.com/~/media/Documents/Products/Data%20Sheet/NOR%20Flash/Serial%20NOR/M25P/M25P80.pdf; ComponentLink3Description: Package Specification; ComponentLink3URL: http://www.micron.com/~/media/Documents/Products/Data%20Sheet/NOR%20Flash/Serial%20NOR/M25P/M25P05A.pdf
U8 = 24AA02HT-I/OT: 2Kbit, 400kHz, 1.7V, I2C Serial EEPROM, 5-Pin SOT-23, Industrial Temperature, Tape and Reel; Manufacturer: Microchip; DatasheetVersion: revA, Sep-2008; PackageVersion: revBB, Aug-2009; PackageReference: SOT-23-OT5; PackageDescription: 5-Lead Plastic Small Outline Transistor (OT) [SOT-23]; Supplier 1: Digi-Key; Supplier Part Number 1: 24AA02HT-I/OT-ND; Supplier 2: Mouser; Supplier Part Number 2: 579-24AA02HT-I/OT; Mounting Technology: Surface Mount; Code_IPC: SOT23-5; PartNumber: 24AA02HT-I/OT; ComponentLink1Description: Manufacturer URL; ComponentLink1URL: http://www.microchip.com/; ComponentLink2Description: Datasheet; ComponentLink2URL: http://ww1.microchip.com/downloads/en/DeviceDoc/22105A.pdf; ComponentLink3Description: Package Specification; ComponentLink3URL: http://www.microchip.com/stellent/groups/techpub_sg/documents/packagingspec/en012702.pdf